# EasyEDA schematic LiPoChargeProtectBoost copy_2020-07-07_22-55-24.json
TITLE: LiPo Charge/Protect/Boost; REV: 1.0; Date: 2017-07-31; Sheet: 1/1; Drawn By: GreatScott
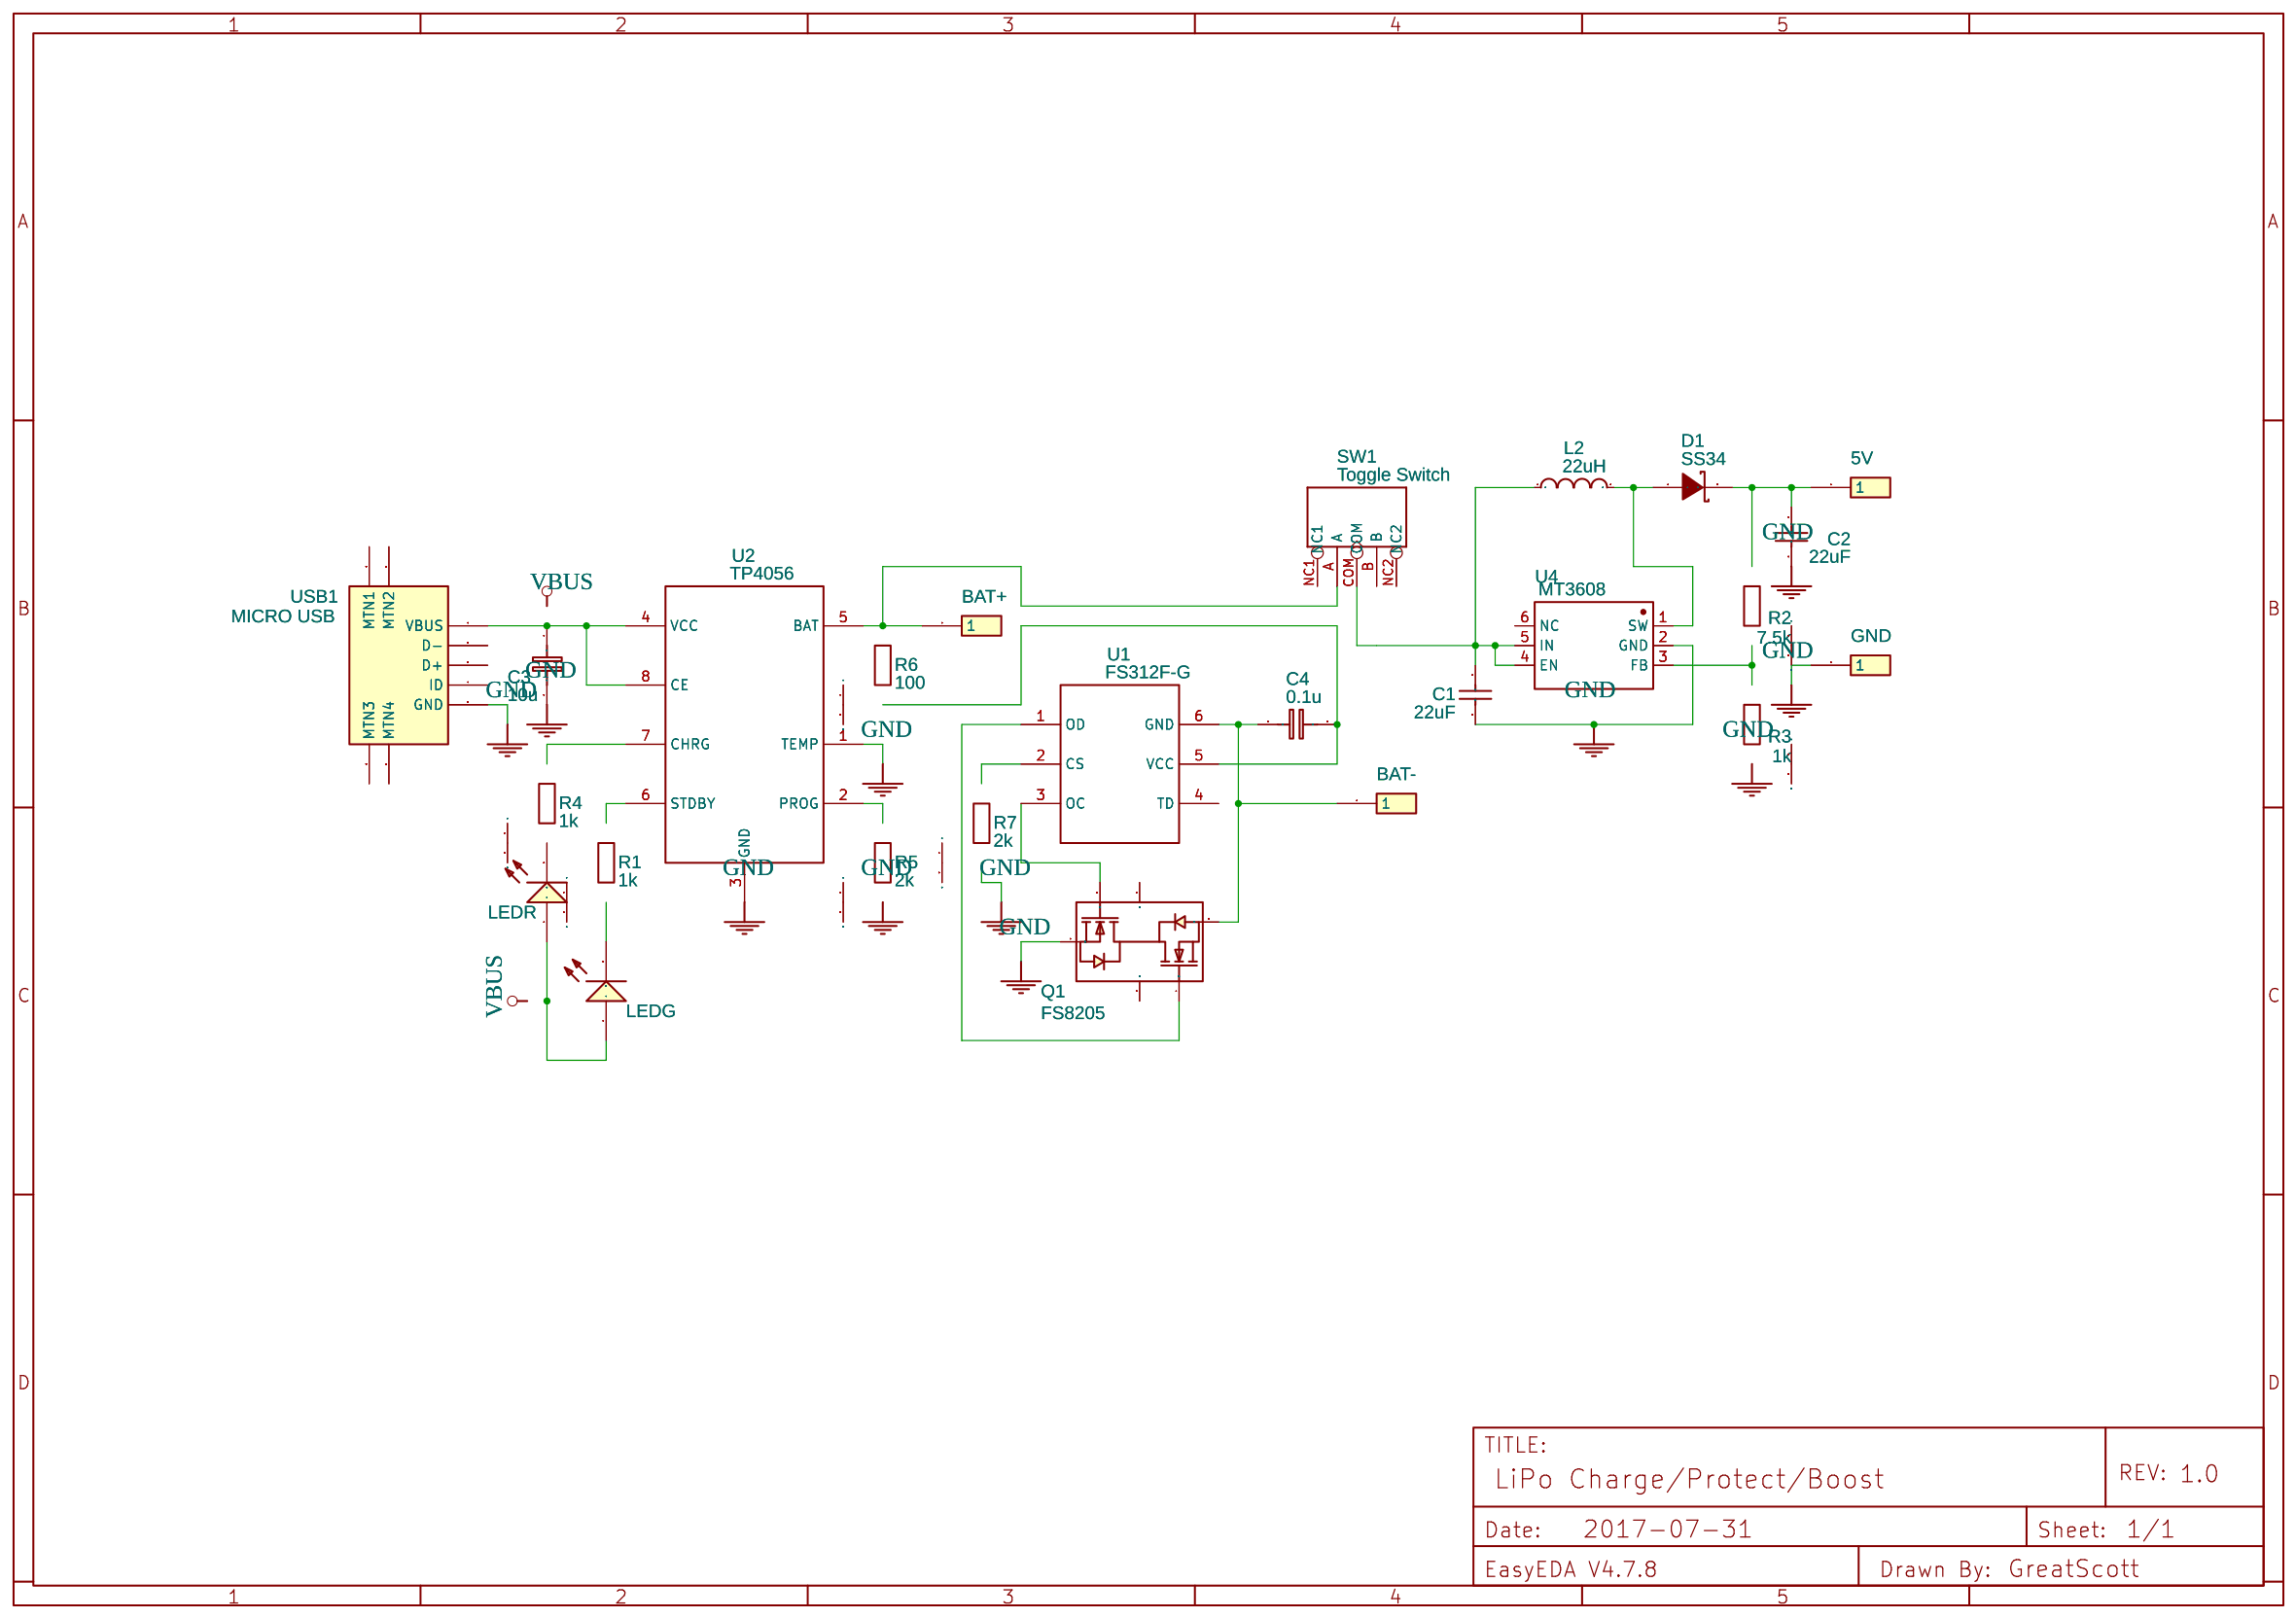
[diagram p0: schematic sheet]

## Parts
5V  5V  [HDR-1X1/2.54]
BAT+  BAT+  [HDR-1X1/2.54]
BAT-  BAT-  [HDR-1X1/2.54]
C1  22uF  [1812]
C2  22uF  [1812]
C3  10u  [0603]
C4  0.1u  [0603]
D1  SS34  [SMA(DO-214AC)]
GND  GND  [HDR-1X1/2.54]
L2  22uH  [7*7*4]
LEDG  19-217/GHC-YR1S2/3T  [LED-0603]
LEDR  Red(0603)  [LED-0603]
Q1  FS8205  [SOT-23-6]
R1  1k  [0603]
R2  7.5k  [0603]
R3  1k  [0603]
R4  1k  [0603]
R5  2k  [0603]
R6  100  [0603]
R7  2k  [0603]
SW1  Toggle Switch  [SW5-2.0-8.8X4.4X4.7MM-90D]
U1  FS312F-G  [SOT-23-6]
U2  TP4056  [SOP-8_EP_150MIL]
U4  MT3608  [SOT-23-6]
USB1  MICRO USB  [MICRO-USB-1]

## Library data of the parts
5V BAT+ BAT- GND = -: Supplier: LCSC; Manufacturer: LCSC; Manufacturer Part: Header-Male-2.54_1x1; Supplier Part: C81276
C1 C2 = -: Voltage: 25V; Tolerance: ±10%; Supplier: LCSC; Manufacturer: FH; Manufacturer Part: 1812X226K250NT; Supplier Part: C28504
C3 C4 = Capacitor: Manufacturer Part: ?
D1 = -: Supplier: LCSC; Supplier Part: C8678
L2 = -: Supplier: LCSC; Manufacturer: LCSC; Manufacturer Part: SMRH74-220MT; Supplier Part: C27442
LEDG = -: Supplier: LCSC; Manufacturer: EVERLIGHT; Supplier Part: C72043
LEDR = -: Supplier: LCSC; Manufacturer: LCSC; Manufacturer Part: KT-0603R; Supplier Part: C2286
Q1 = -: Supplier: LCSC; Manufacturer: FORTUNE; Supplier Part: C32254
R1-R7 = Resistor: Manufacturer Part: ?
SW1 = -: DIP Toggle Switch ON-ON; 0.3A- AC 500V; catid: 20; Manufacturer Part: 3P-2.0-90D-REINFORCE;
U1 = -: Supplier: LCSC; Manufacturer: FORTUNE; Manufacturer Part: DW01+G; Supplier Part: C14213
U2 = -: Contributor: Guest; Supplier: LCSC; Manufacturer: TOPPOWER; Supplier Part: C16581
U4 = -: Supplier: LCSC; Manufacturer: LCSC; Supplier Part: C84817
USB1 = -: Supplier: LCSC; Manufacturer: LCSC; Manufacturer Part: MICRO USB 5S B; Supplier Part: C10418

## Nets
GND: C1.1 C2.2 C3.2 GND.1 Q1.1(S1) R3.1 R5.1 R7.1 U2.1(TEMP) U2.3(GND) U4.2(GND) USB1.5(GND)
VBUS: C3.1 LEDG.1(A) LEDR.1(A) U2.4(VCC) U2.8(CE) USB1.1(VBUS)
Net-(5V-1): 5V.1 C2.1 D1.2(K) R2.2
Net-(BAT+-1): BAT+.1 R6.2 SW1.A U2.5(BAT)
Net-(BAT--1): BAT-.1 C4.1 Q1.3(S2) U1.6(GND)
Net-(C1-2): C1.2 L2.1 SW1.COM U4.4(EN) U4.5(IN)
Net-(C4-2): C4.2 R6.1 U1.5(VCC)
Net-(D1-1): D1.1(A) L2.2 U4.1(SW)
Net-(LEDG-2): LEDG.2(C) R1.1
Net-(LEDR-2): LEDR.2(C) R4.1
Net-(Q1-4): Q1.4(G2) U1.1(OD)
Net-(Q1-6): Q1.6(G1) U1.3(OC)
Net-(R1-2): R1.2 U2.6(STDBY)
Net-(R2-1): R2.1 R3.2 U4.3(FB)
Net-(R4-2): R4.2 U2.7(CHRG)
Net-(R5-2): R5.2 U2.2(PROG)
Net-(R7-2): R7.2 U1.2(CS)

Not connected (* = marked no-connect by the designer): Q1 2(D12) 5(D12); SW1 B NC1 NC2; U1 4(TD); U4 6(NC); USB1 0(MTN1) 2(D-) 3(D+) 4(ID)
